# EAGLE design dongle-zigbit (EAGLE 5.10)
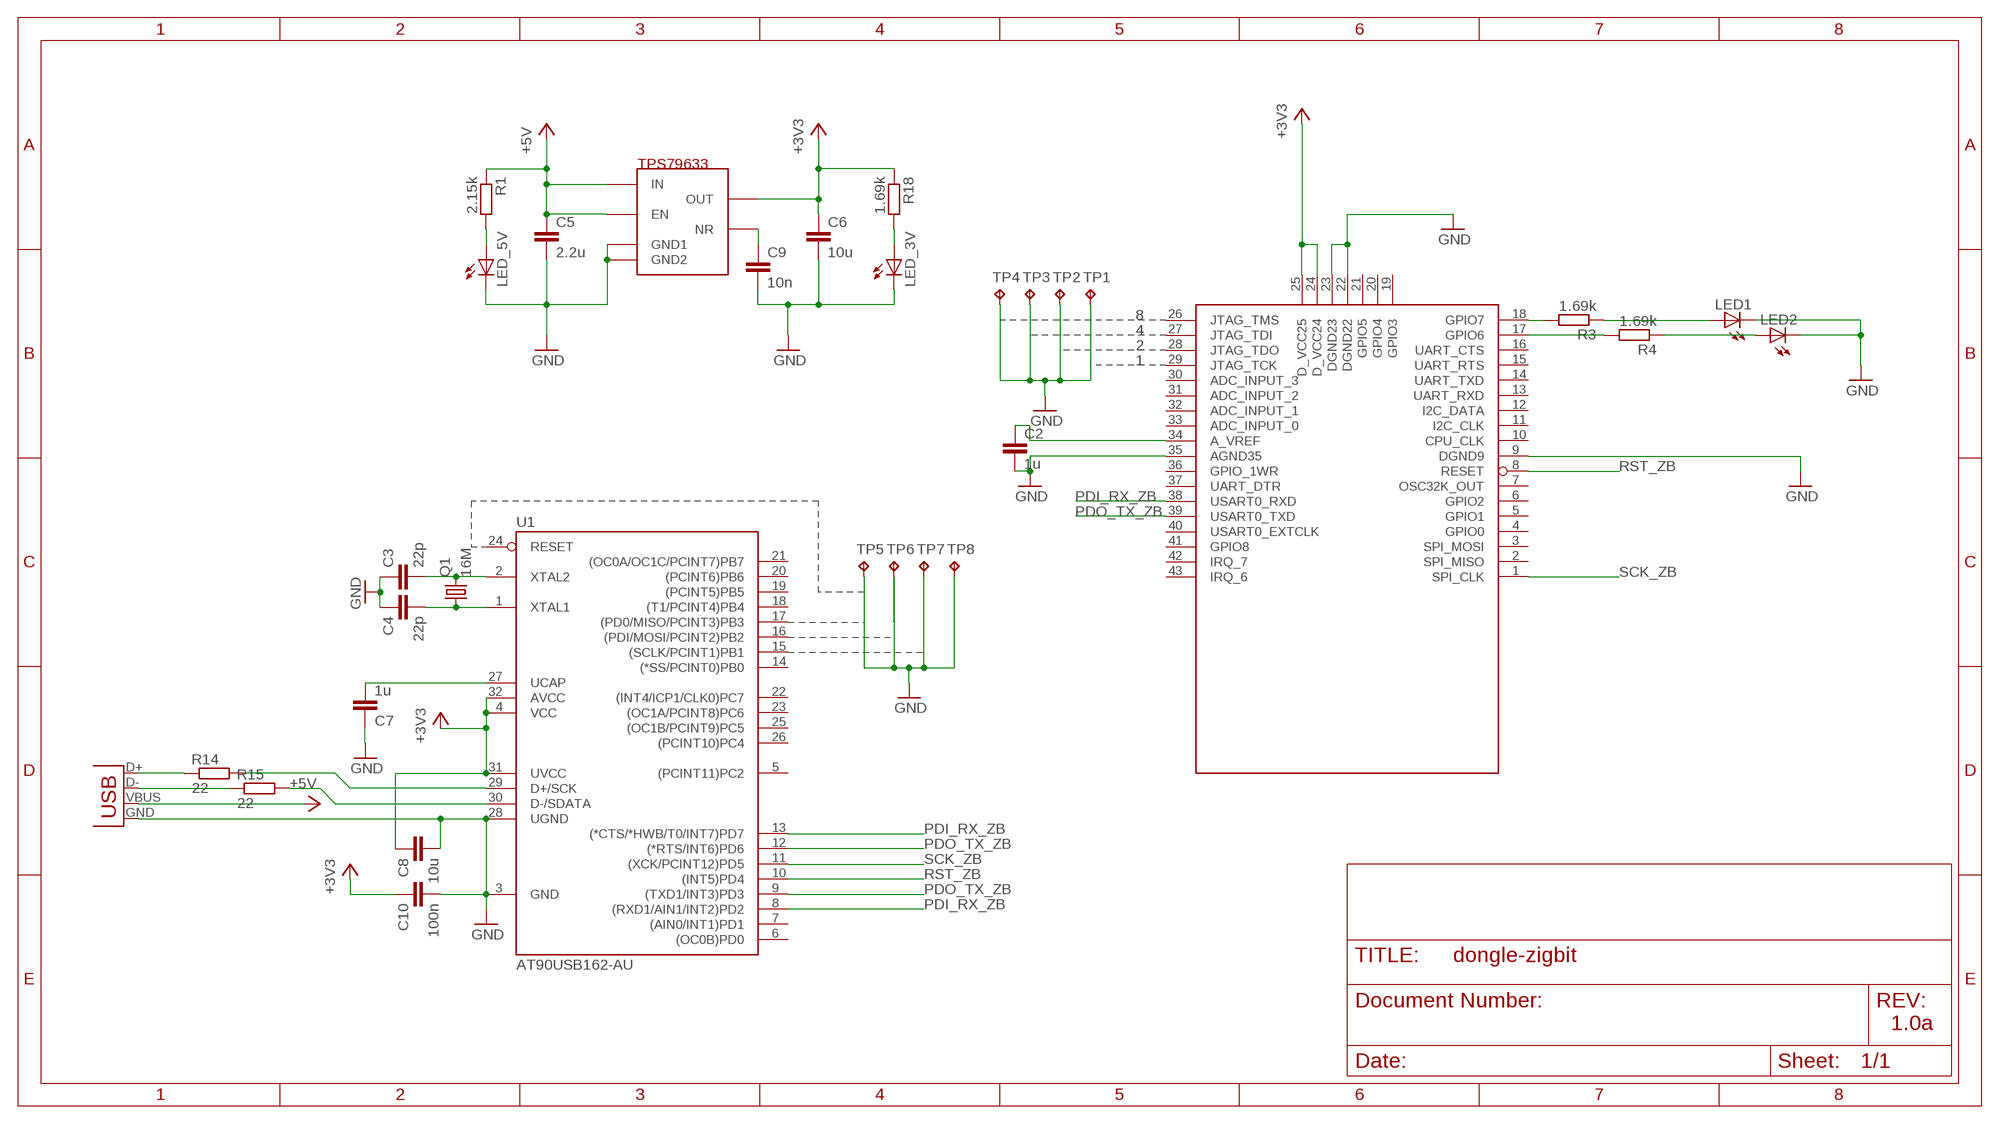
[diagram p0: schematic, sheet 1]

## Parts
C2  1u  C-EUC0805  [C0805]
C3  22p  C-EUC0603  [C0603]
C4  22p  C-EUC0603  [C0603]
C5  2.2u  C-EUC0805  [C0805]
C6  10u  C-EUC1210  [C1210]
C7  1u  C-EUC0603  [C0603]
C8  10u  C-EUC0603  [C0603]
C9  10n  C-EUC0603  [C0603]
C10  100n  C-EUC0603  [C0603]
LED1  LEDSMT1206  [1206]
LED2  LEDSMT1206  [1206]
LED_3V  LEDSMT1206  [1206]
LED_5V  LEDSMT1206  [1206]
Q1  16M  QUARTZ  [ABM3]
R1  2.15k  R-EU_R0603  [R0603]
R3  1.69k  R-EU_R0603  [R0603]
R4  1.69k  R-EU_R0603  [R0603]
R14  22  R-EU_R0603  [R0603]
R15  22  R-EU_R0603  [R0603]
R18  1.69k  R-EU_R0603  [R0603]
TP1  TPTP06SQ  [TP06SQ]
TP2  TPTP06SQ  [TP06SQ]
TP3  TPTP06SQ  [TP06SQ]
TP4  TPTP06SQ  [TP06SQ]
TP5  TPTP06SQ  [TP06SQ]
TP6  TPTP06SQ  [TP06SQ]
TP7  TPTP06SQ  [TP06SQ]
TP8  TPTP06SQ  [TP06SQ]
U1  AT90USB162-AU  [TQFP32-08]
U2  TPS79633  [SOT223-5]
U$1  ATZB-24-A2  [ATZB-24-A2R]
X1  USB-A-SMT  [USB-A-SMT]

## Nets
+3V3: C6.1 C8.1 C10.1 R18.1 U1.4(VCC) U1.31(UVCC) U1.32(AVCC) U2.4(OUT) U$1.24(D_VCC24) U$1.25(D_VCC25)
+5V: C5.1 R1.1 U2.1(EN) U2.2(IN) X1.VBUS
AVRDM: R15.2 U1.30(D-/SDATA)
AVRDP: R14.2 U1.29(D+/SCK)
DM: R15.1 X1.D-
DP: R14.1 X1.D+
GND [supply]: C2.2 C3.1 C4.1 C5.2 C6.2 C7.1 C8.2 C9.2 C10.2 LED1.C LED2.C LED_3V.C LED_5V.C TP1.TP TP2.TP TP3.TP TP4.TP TP5.TP TP6.TP TP7.TP TP8.TP U1.3(GND) U1.28(UGND) U2.3(GND1) U2.6(GND2) U$1.9(DGND9) U$1.22(DGND22) U$1.23(DGND23) U$1.35(AGND35) X1.GND
N$1: C9.1 U2.5(NR)
N$2: R3.2 U$1.18(GPIO7)
N$3: C7.2 U1.27(UCAP)
N$4: LED_5V.A R1.2
N$6: LED1.A R3.1
N$9: LED2.A R4.1
N$10: R4.2 U$1.17(GPIO6)
N$20: LED_3V.A R18.2
N$21: C2.1 U$1.34(A_VREF)
PDI_RX_ZB: U1.8((RXD1/AIN1/INT2)PD2) U1.13((*CTS/*HWB/T0/INT7)PD7) U$1.38(USART0_RXD)
PDO_TX_ZB: U1.9((TXD1/INT3)PD3) U1.12((*RTS/INT6)PD6) U$1.39(USART0_TXD)
RST_ZB: U1.10((INT5)PD4) U$1.8(RESET)
SCK_ZB: U1.11((XCK/PCINT12)PD5) U$1.1(SPI_CLK)
XTAL1: C4.2 Q1.1 U1.1(XTAL1)
XTAL2: C3.2 Q1.2 U1.2(XTAL2)
Unconnected: U1.5((PCINT11)PC2) U1.6((OC0B)PD0) U1.7((AIN0/INT1)PD1) U1.14((*SS/PCINT0)PB0) U1.15((SCLK/PCINT1)PB1) U1.16((PDI/MOSI/PCINT2)PB2) U1.17((PD0/MISO/PCINT3)PB3) U1.18((T1/PCINT4)PB4) U1.19((PCINT5)PB5) U1.20((PCINT6)PB6) U1.21((OC0A/OC1C/PCINT7)PB7) U1.22((INT4/ICP1/CLK0)PC7) U1.23((OC1A/PCINT8)PC6) U1.24(RESET) U1.25((OC1B/PCINT9)PC5) U1.26((PCINT10)PC4) U$1.2(SPI_MISO) U$1.3(SPI_MOSI) U$1.4(GPIO0) U$1.5(GPIO1) U$1.6(GPIO2) U$1.7(OSC32K_OUT) U$1.10(CPU_CLK) U$1.11(I2C_CLK) U$1.12(I2C_DATA) U$1.13(UART_RXD) U$1.14(UART_TXD) U$1.15(UART_RTS) U$1.16(UART_CTS) U$1.19(GPIO3) U$1.20(GPIO4) U$1.21(GPIO5) U$1.26(JTAG_TMS) U$1.27(JTAG_TDI) U$1.28(JTAG_TDO) U$1.29(JTAG_TCK) U$1.30(ADC_INPUT_3) U$1.31(ADC_INPUT_2) U$1.32(ADC_INPUT_1) U$1.33(ADC_INPUT_0) U$1.36(GPIO_1WR) U$1.37(UART_DTR) U$1.40(USART0_EXTCLK) U$1.41(GPIO8) U$1.42(IRQ_7) U$1.43(IRQ_6)

## Notes on the sheet
- 8
- 4
- 2
- 1
- 1.0a

## Library data of the parts
C2-C10 = rcl:C-EU: CAPACITOR, European symbol
LED1 LED2 LED_3V LED_5V = led:LED: LED OSRAM: - CHIPLED LG R971, LG N971, LY N971, LG Q971, LY Q971, LO R971, LY R971 LH N974, LH R974 LS Q976, LO Q976, LY Q976 LO Q996 - Hyper CHIPLED LW Q18S LB Q993, LB Q99A, LB R99A - SideLED LS A670, LO A670, LY A670, LG A670, LP A670 LB A673, LV A673, LT A673, LW A673 LH A674 LY A675 LS A676, LA A676, LO A676, LY A676, LW A676 LS A679, LY A679, LG A679 - Hyper Micro SIDELED® LS Y876, LA Y876, LO Y876, LY Y876 LT Y87S - SmartLED LW L88C, LW L88S LB L89C, LB L89S, LG L890 LS L89K, LO L89K, LY L89K LS L896, LA L896, LO L896, LY L896 - TOPLED LS T670, LO T670, LY T670, LG T670, LP T670 LSG T670, LSP T670, LSY T670, LOP T670, LYG T670 LG T671, LOG T671, LSG T671 LB T673, LV T673, LT T673, LW T673 LH T674 LS T676, LA T676, LO T676, LY T676, LB T676, LH T676, LSB T676, LW T676 LB T67C, LV T67C, LT T67C, LS T67K, LO T67K, LY T67K, LW E67C LS E67B, LA E67B, LO E67B, LY E67B, LB E67C, LV E67C, LT E67C LW T67C LS T679, LY T679, LG T679 LS T770, LO T770, LY T770, LG T770, LP T770 LB T773, LV T773, LT T773, LW T773 LH T774 LS E675, LA E675, LY E675, LS T675 LS T776, LA T776, LO T776, LY T776, LB T776 LHGB T686 LT T68C, LB T68C - Hyper Mini TOPLED® LB M676 - Mini TOPLED Santana® LG M470 LS M47K, LO M47K, LY M47K Source: http://www.osram.convergy.de LUXEON: - LUMILED® LXK2-PW12-R00, LXK2-PW12-S00, LXK2-PW14-U00, LXK2-PW14-V00 LXK2-PM12-R00, LXK2-PM12-S00, LXK2-PM14-U00 LXK2-PE12-Q00, LXK2-PE12-R00, LXK2-PE12-S00, LXK2-PE14-T00, LXK2-PE14-U00 LXK2-PB12-K00, LXK2-PB12-L00, LXK2-PB12-M00, LXK2-PB14-N00, LXK2-PB14-P00, LXK2-PB14-Q00 LXK2-PR12-L00, LXK2-PR12-M00, LXK2-PR14-Q00, LXK2-PR14-R00 LXK2-PD12-Q00, LXK2-PD12-R00, LXK2-PD12-S00 LXK2-PH12-R00, LXK2-PH12-S00 LXK2-PL12-P00, LXK2-PL12-Q00, LXK2-PL12-R00 Source: www.luxeon.com KINGBRIGHT: KA-3528ASYC Source: www.kingbright.com
Q1 = ni-crystal:QUARTZ
R1 R3 R4 R18 = rcl:R-EU_: RESISTOR, European symbol
R14 R15 = apbteam_rcl:R-EU_: RESISTOR, European symbol
TP1-TP8 = testpad:TP: Test pad
U1 = at90usb:AT90USB162-*
U2 = zigbit:TPS79633
U$1 = apbteam_zigbit:ATZB-24-A2: ATZB-24-A2 Package (Dual antenna Zigbit module) Created by florent@duchon.cc
X1 = apbteam_con-usb:USB: USB Connectors

## Net classes
1 supply: width 0.203 mm

## Board
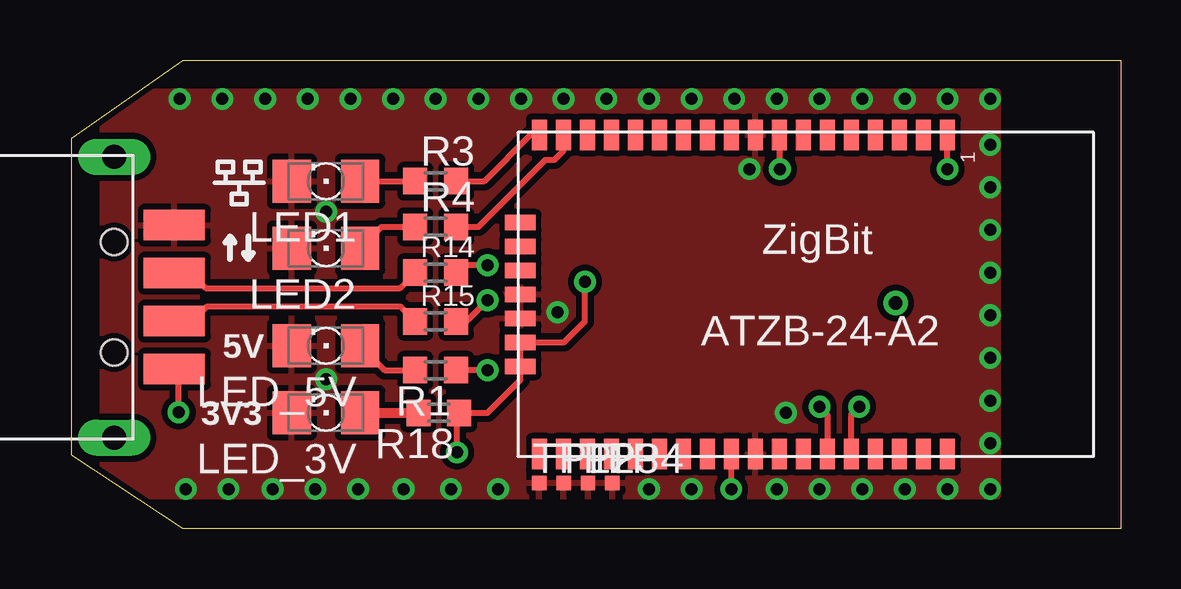
[diagram p1: board, top side]
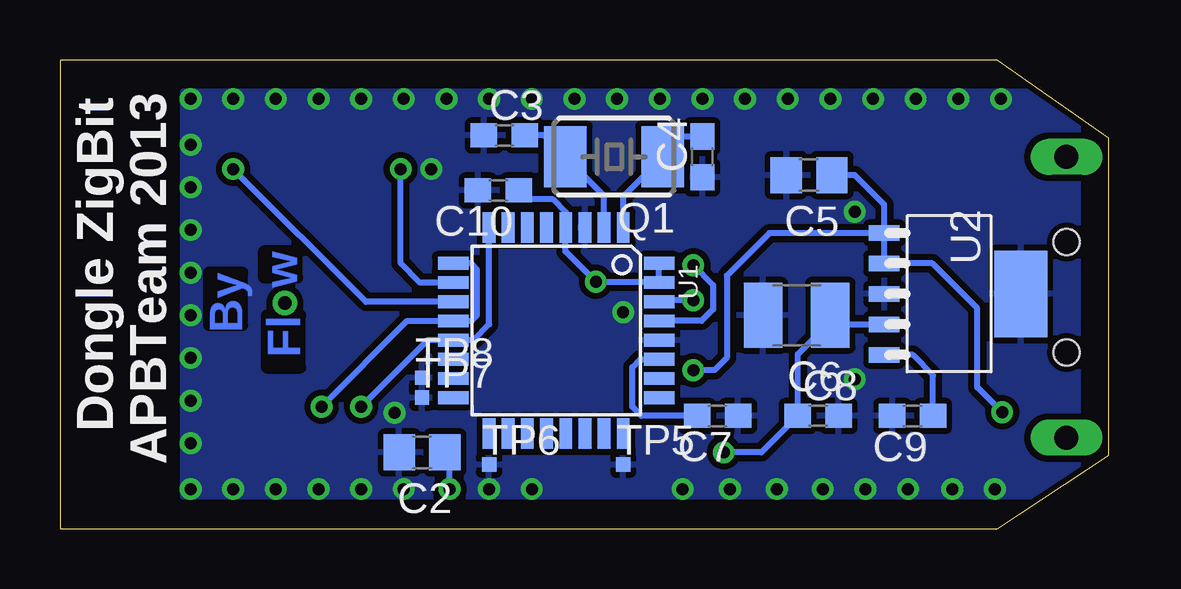
[diagram p2: board, bottom side, seen from below]

Size 43.72 x 19.54 mm. Coordinates in mm from the lower left corner, seen from the top.
Outline: 4.64,0 43.72,0 43.72,19.54 4.64,19.54 0,16.27 0,3.07 4.64,0
Outline: 4.64,0 4.64,0
Copper layers (1*16): Top 0.035mm / dielectric 1.5mm / Bottom 0.035mm
Design rules "Dipole-electronique": minimum track width 0.2mm, minimum drill 0.5mm, track to track 0.2mm, track to pad 0.2mm, pad to pad 0.2mm, via to via 0.2mm, smd to smd 0.2mm, copper to edge 0.2mm, drill to drill 8mil, minimum pad ring 10mil, minimum via ring 8mil, stop-mask expansion 4mil, vias tented up to drill 0mil, thermal gap 10mil

### Footprints (pad centres in the part's own frame; a part is rotated, then mirrored left to right if it is on the bottom)
C0805 = smd 1.3 x 1.5: 1 -0.95,0; 2 0.95,0
C0603 = smd 1.1 x 1: 1 -0.85,0; 2 0.85,0
C1210 = smd 1.6 x 2.7: 1 -1.4,0; 2 1.4,0
1206 = smd 1.6 x 1.803: A -1.422,0; C 1.422,0
ABM3 = smd 1.778 x 2.54: 1 -2.032,0; 2 2.032,0
R0603 = smd 1 x 1.1: 1 -0.85,0; 2 0.85,0
TP06SQ = smd 0.6 x 0.6: TP 0,0
TQFP32-08 = smd 1.27 x 0.533: 1 -4.293,2.8; 2 -4.293,2; 3 -4.293,1.2; 4 -4.293,0.4; 5 -4.293,-0.4; 6 -4.293,-1.2; 7 -4.293,-2; 8 -4.293,-2.8; 17 4.293,-2.8; 18 4.293,-2; 19 4.293,-1.2; 20 4.293,-0.4; 21 4.293,0.4; 22 4.293,1.2; 23 4.293,2; 24 4.293,2.8 | smd 0.533 x 1.27: 9 -2.8,-4.293; 10 -2,-4.293; 11 -1.2,-4.293; 12 -0.4,-4.293; 13 0.4,-4.293; 14 1.2,-4.293; 15 2,-4.293; 16 2.8,-4.293; 25 2.8,4.293; 26 2,4.293; 27 1.2,4.293; 28 0.4,4.293; 29 -0.4,4.293; 30 -1.2,4.293; 31 -2,4.293; 32 -2.8,4.293
SOT223-5 = smd 0.635 x 1.27: 1 -2.54,-2.7; 2 -1.27,-2.7; 3 0,-2.7; 4 1.27,-2.7; 5 2.54,-2.7 | smd 3.6 x 2.2: 6 0,3
ATZB-24-A2R = smd 0.635 x 1.27: 1 17.9,-0.1; 2 16.9,-0.1; 3 15.9,-0.1; 4 14.9,-0.1; 5 13.9,-0.1; 6 12.9,-0.1; 7 11.9,-0.1; 8 10.9,-0.1; 9 9.9,-0.1; 10 8.9,-0.1; 11 7.9,-0.1; 12 6.9,-0.1; 13 5.9,-0.1; 14 4.9,-0.1; 15 3.9,-0.1; 16 2.9,-0.1; 17 1.9,-0.1; 18 0.9,-0.1; 26 0.9,-13.4; 27 1.9,-13.4; 28 2.9,-13.4; 29 3.9,-13.4; 30 4.9,-13.4; 31 5.9,-13.4; 32 6.9,-13.4; 33 7.9,-13.4; 34 8.9,-13.4; 35 9.9,-13.4; 36 10.9,-13.4; 37 11.9,-13.4; 38 12.9,-13.4; 39 13.9,-13.4; 40 14.9,-13.4; 41 15.9,-13.4; 42 16.9,-13.4; 43 17.9,-13.4 | smd 1.27 x 0.635: 19 0.1,-3.75; 20 0.1,-4.75; 21 0.1,-5.75; 22 0.1,-6.75; 23 0.1,-7.75; 24 0.1,-8.75; 25 0.1,-9.75
USB-A-SMT = smd 2.54 x 1.27: D+ 2.5,1; D- 2.5,-1; GND 2.5,3; VBUS 2.5,-3 | drill 1 long: P$1 0,5.85; P$2 0,-5.85 | hole 1.1: 0,2.3; 0,-2.3

### Placement (x,y rotation side)
C2  28.62,3.19 180 bottom
C3  25.2,16.39 0 bottom
C4  16.94,15.51 90 bottom
C5  12.5,14.74 180 bottom
C6  13.01,8.9 180 bottom
C7  16.31,4.71 180 bottom
C8  12.11,4.71 0 bottom
C9  8.18,4.71 180 bottom
C10  25.45,14.11 180 bottom
LED1  10.59,14.49 180 top
LED2  10.59,11.7 180 top
LED_3V  10.59,4.84 180 top
LED_5V  10.59,7.63 180 top
Q1  20.62,15.51 180 bottom
R1  15.16,6.62 180 top
R3  15.16,14.49 0 top
R4  15.16,12.58 0 top
R14  15.16,10.68 0 top
R15  15.16,8.65 0 top
R18  15.29,4.84 180 top
TP1  19.48,1.92 0 top
TP2  20.5,1.92 0 top
TP3  21.51,1.92 0 top
TP4  22.53,1.92 0 top
TP5  20.24,2.68 0 bottom
TP6  25.83,2.68 0 bottom
TP7  28.62,5.47 0 bottom
TP8  28.62,6.3 0 bottom
U1  23.04,8.27 270 bottom
U2  6.66,9.79 270 bottom
U$1  18.59,16.52 0 top
X1  1.76,9.66 0 top

### Tracks (layer width: path | path; a pad name or v marks a point on that pad's centre or on a via)
+3V3  (via drill 0.5)
  Top 0.254: v21.39,10.3 21.39,8.65 20.51,7.77 U$1.24 U$1.25 18.69,6.21 17.32,4.84 16.22,4.84 16.18,4.8 R18.1 16.05,4.75 v16.05,3.19
  Bottom 0.254: C10.1 24.22,13.73 23.16,13.73 22.64,13.2 U1.4 22.64,11.59 22.66,11.57 v21.39,10.3 18.78,10.3 U1.31 U1.32 | v16.05,3.19 14.49,3.19 C8.1 12.96,7.29 11.61,8.64 C6.1 11.23,8.9 10.84,8.52 U2.4
+5V  (via drill 0.5)
  Top 0.254: v17.32,6.62 R1.1 | X1.VBUS 4.44,6.47 v4.44,4.86
  Bottom 0.254: 11.39,14.74 C5.1 10.59,14.74 9.36,13.52 U2.1 | v17.32,6.62 16.43,6.62 15.92,7.12 15.92,10.55 14.15,12.33 U2.1 | U2.1 9.07,12.42 | U2.1 8.96,12.32 | U2.1 U2.2 7.36,11.06 5.49,9.19 5.49,5.9 v4.44,4.86
AVRDM  (via drill 0.5)
  Top 0.254: R15.2 16.12,8.33 v17.32,9.53
  Bottom 0.254: U1.30 18.68,9.53 v17.32,9.53
AVRDP  (via drill 0.5)
  Top 0.254: 16.02,10.99 16.05,10.96 | 16.02,10.99 R14.2 | v17.32,10.99 16.02,10.99
  Bottom 0.254: 18.72,8.65 U1.29 16.98,8.67 16.5,9.15 16.5,10.16 v17.32,10.99
DM
  Top 0.254: R15.1 | X1.D- 5.02,8.66 5.64,9.27 13.69,9.27 R15.1 | R15.1 13.95,8.33
DP
  Top 0.254: R14.1 | X1.D+ 4.83,10.78 5.57,10.04 13.67,10.04 R14.1 | R14.1 13.96,11
GND  (via drill 0.5)
  other vias: 36.5,17.92 34.72,17.92 32.94,17.92 31.16,17.92 29.39,17.92 27.61,17.92 25.83,17.92 13.38,17.92 15.16,17.92 16.94,17.92 18.72,17.92 20.5,17.92 22.27,17.92 24.05,17.92 4.49,17.92 6.27,17.92 8.05,17.92 9.83,17.92 11.61,17.92 13.83,1.66 15.8,1.66 17.77,1.66 24.05,1.66 4.75,1.66 6.53,1.66 8.37,1.66 10.15,1.66 11.92,1.66 29.39,1.66 31.16,1.66 32.94,1.66 34.72,1.66 36.5,1.66 25.83,1.66 38.28,7.12 38.28,8.9 38.28,10.68 38.28,12.46 38.28,14.24 38.28,16.01 38.28,17.92 38.28,5.35 38.28,3.57 38.28,1.66 20.24,9.03 10.59,6.23 10.59,13.22 28.24,15 29.77,4.84
  pour Bottom (isolate 0.254): 38.59,18.24 1.29,18.24 1.29,1.35 38.59,1.35
  pour Top (isolate 0.254): 1.29,18.24 38.59,18.24 38.59,1.35 1.29,1.35
N$1
  Bottom 0.254: C9.1 7.33,6.4 8.18,7.25 U2.5
N$2
  Top 0.254: R3.2 17.19,14.49 19.13,16.42 U$1.18
N$3
  Bottom 0.254: U1.27 19.54,7.07 19.86,6.74 19.86,5.09 19.48,4.71 C7.2 17.58,4.33
N$4
  Top 0.254: LED_5V.A 13.03,6.62 R1.2
N$5  (via drill 0.56 pad 1.02)
  other vias: 34.34,9.41
N$6
  Top 0.254: LED1.A R3.1
N$9
  Top 0.254: LED2.A 12.9,12.58 R4.1
N$10
  Top 0.254: R4.2 16.94,12.58 19.73,15.38 20.12,15.38 20.49,15.75 U$1.17
N$20
  Top 0.406: LED_3V.A R18.2
N$21  (via drill 0.5)
  Top 0.254: U$1.34 27.49,1.67 v27.48,1.66
  Bottom 0.254: v27.48,1.66 27.48,2.99 C2.1
PDI_RX_ZB  (via drill 0.5)
  Top 0.254: v31.16,5.09 31.49,4.76 U$1.38
  Bottom 0.254: U1.8 25.83,8.52 26.48,7.87 U1.13 28.39,7.87 v31.16,5.09
PDO_TX_ZB  (via drill 0.5)
  Top 0.254: v32.82,5.09 32.49,4.77 U$1.39
  Bottom 0.254: U1.9 26.59,11.06 26.34,10.81 26.34,8.9 26.57,8.67 U1.12 29.24,8.67 v32.82,5.09
RST_ZB  (via drill 0.5)
  Top 0.254: v29.51,15 29.51,16.4 U$1.8
  Bottom 0.254: v29.51,15 29.51,11.06 28.72,10.27 U1.10
SCK_ZB  (via drill 0.5)
  Top 0.254: v36.5,15 U$1.1
  Bottom 0.254: U1.11 30.97,9.47 v36.5,15
XTAL1
  Bottom 0.254: U1.1 20.24,13.86 Q1.1 17.74,16.36 C4.2
XTAL2
  Bottom 0.254: U1.2 21.04,13.89 Q1.2 23.54,16.39 C3.2

### Text on the board
Bottom: w | By | Fl
tSilk: 5V | 3V3
bSilk: APBTeam 2013 | Dongle ZigBit